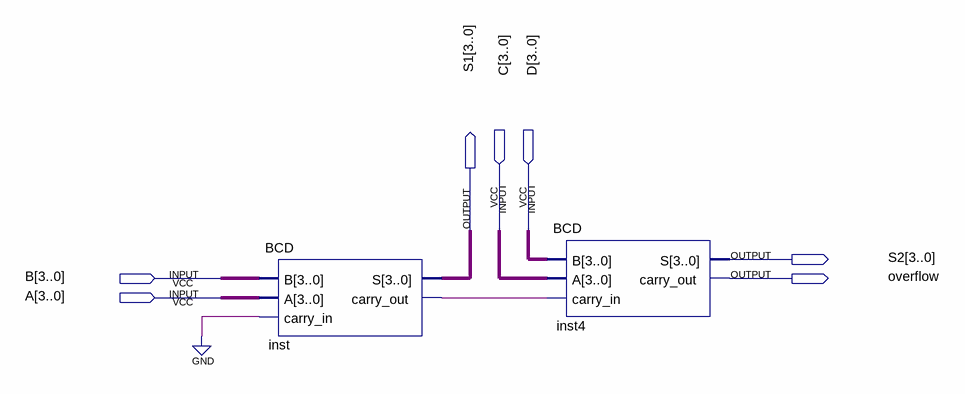
[diagram p0: schematic sheet]
// Quartus schematic BCD_2D.bdf as structural Verilog: 2 symbols, 7 pins
module BCD_2D (
  input  [3:0] C,
  input  [3:0] D,
  input  [3:0] B,
  input  [3:0] A,
  output [3:0] S1,
  output [3:0] S2,
  output overflow
);

  wire inst_carry_out;

  BCD inst (.B(B), .A(A), .carry_in(1'b0), .S(S1), .carry_out(inst_carry_out));
  BCD inst4 (.B(D), .A(C), .carry_in(inst_carry_out), .S(S2), .carry_out(overflow));
endmodule
